# Altium schematic sheet SENSOR.SchDoc
size A; SheetNumber: 1; SheetTotal: 1
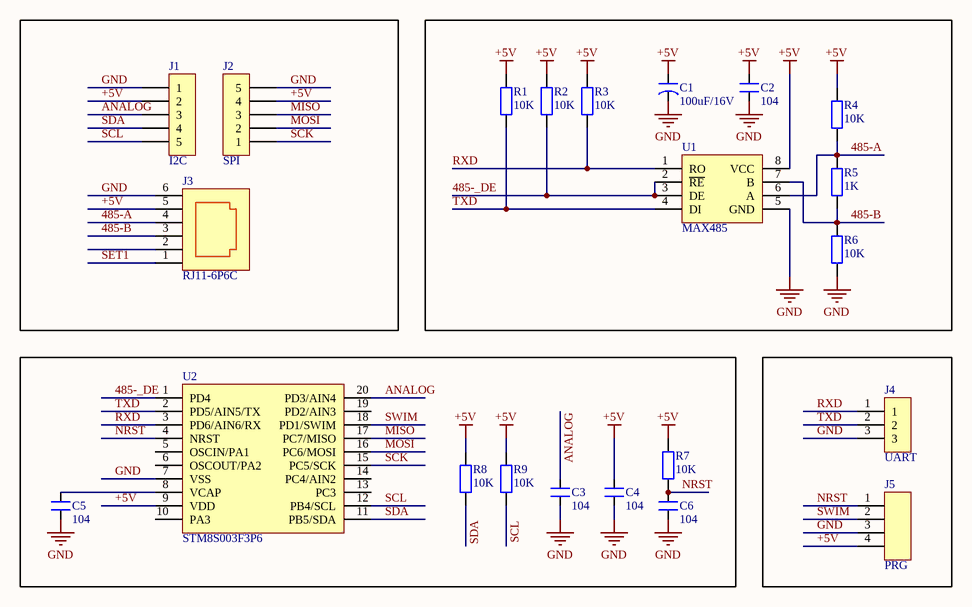
[diagram p0: SENSOR.SchDoc]

## Parts
C1  100uF/16V  [CAP_AL_6.3x5.5]
C2  104  [CAP-0805]
C3  104  [CAP-0805]
C4  104  [CAP-0805]
C5  104  [CAP-0805]
C6  104  [CAP-0805]
J1  I2C  [CON2 15EDG3.81-5P]
J2  SPI  [CON2 15EDG3.81-5P]
J3  RJ11-6P6C  [RJ12-6P6C]
J4  UART  [JUMP_3]
J5  PRG  [Jump_4]
R1  10K  [RES-0805]
R2  10K  [RES-0805]
R3  10K  [RES-0805]
R4  10K  [RES-0805]
R5  1K  [RES-0805]
R6  10K  [RES-0805]
R7  10K  [RES-0805]
R8  10K  [RES-0805]
R9  10K  [RES-0805]
U1  MAX485  [SOP08]
U2  STM8S003F3P6  [TSSOP20]

## Nets
+5V: C1.1 C2.2 C4.2 J1.2 J2.4 J3.5 J5.4 R1.2 R2.2 R3.2 R4.2 R7.2 R8.2 R9.2 U1.8(VCC) U2.9(VDD)
GND: C1.2 C2.1 C3.1 C4.1 C5.1 C6.1 J1.1 J2.5 J3.6 J4.3 J5.3 R6.1 U1.5(GND) U2.7(VSS)
485-_DE: R2.1 U1.2(~{RE}) U1.3(DE) U2.1(PD4)
485-A: J3.4 R4.1 R5.2 U1.6(A)
485-B: J3.3 R5.1 R6.2 U1.7(B)
ANALOG: C3.2 J1.3 U2.20(PD3/AIN4)
MISO: J2.3 U2.17(PC7/MISO)
MOSI: J2.2 U2.16(PC6/MOSI)
NRST: C6.2 J5.1 R7.1 U2.4(NRST)
RXD: J4.1 R3.1 U1.1(RO) U2.3(PD6/AIN6/RX)
SCK: J2.1 U2.15(PC5/SCK)
SCL: J1.5 R9.1 U2.12(PB4/SCL)
SDA: J1.4 R8.1 U2.11(PB5/SDA)
SET1: J3.1
SWIM: J5.2 U2.18(PD1/SWIM)
TXD: J4.2 R1.1 U1.4(DI) U2.2(PD5/AIN5/TX)
NetC5_2: C5.2 U2.8(VCAP)

Not connected (* = marked no-connect by the designer): J3 2; U2 5(OSCIN/PA1) 6(OSCOUT/PA2) 10(PA3) 13(PC3) 14(PC4/AIN2) 19(PD2/AIN3)

## Library data of the parts
C1 = CAP_AL: Cap AL SMD
C2-C6 = CAP: Cap SMD; Value: 103
J1 J2 = Jump_5: Jump_5 Pin 2.54
J3 = RJ11-6P6C: RJ11-6P6C Connecter
J4 = Jump_3: Jump_3 Pin 2.54
J5 = Jump_4: Jump_4 Pin 2.54
R1-R4 R6-R9 = RES: Resistor SMD; Value: 1K
R5 = RES: Resistor SMD; Value: 1K
U1 = MAX485: RS485-Transceivers
U2 = STM8S003F3P6: ARM